# EasyEDA Pro project 2025智能物流搬运_PCB_XAUT_20250927.eprj, board PCB18
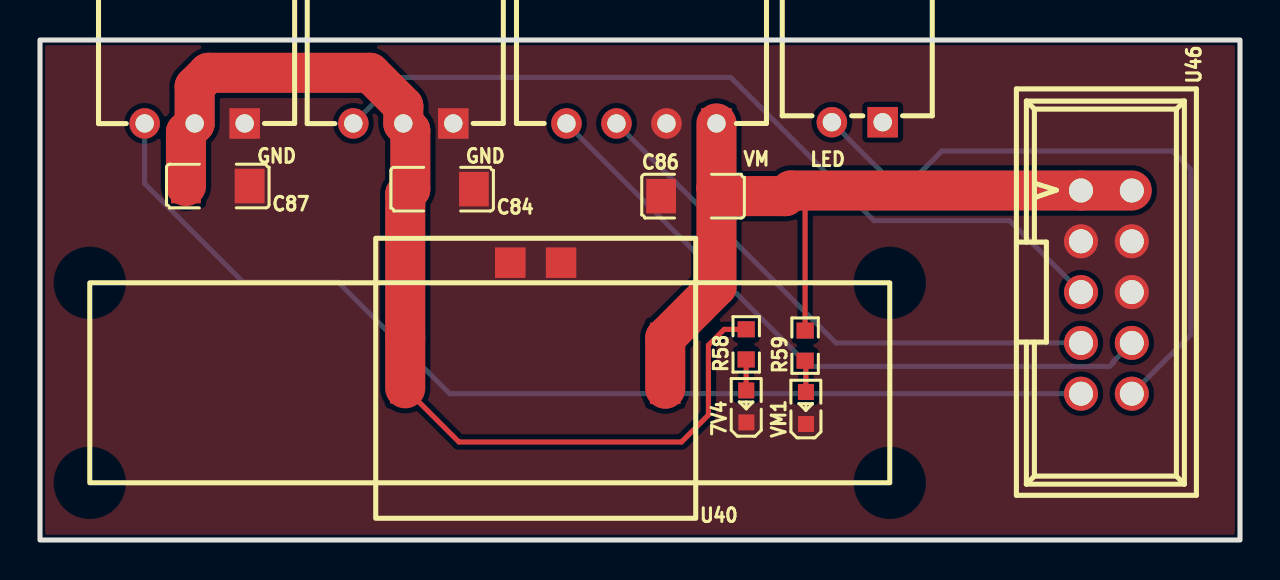
[diagram p13: board, top side]
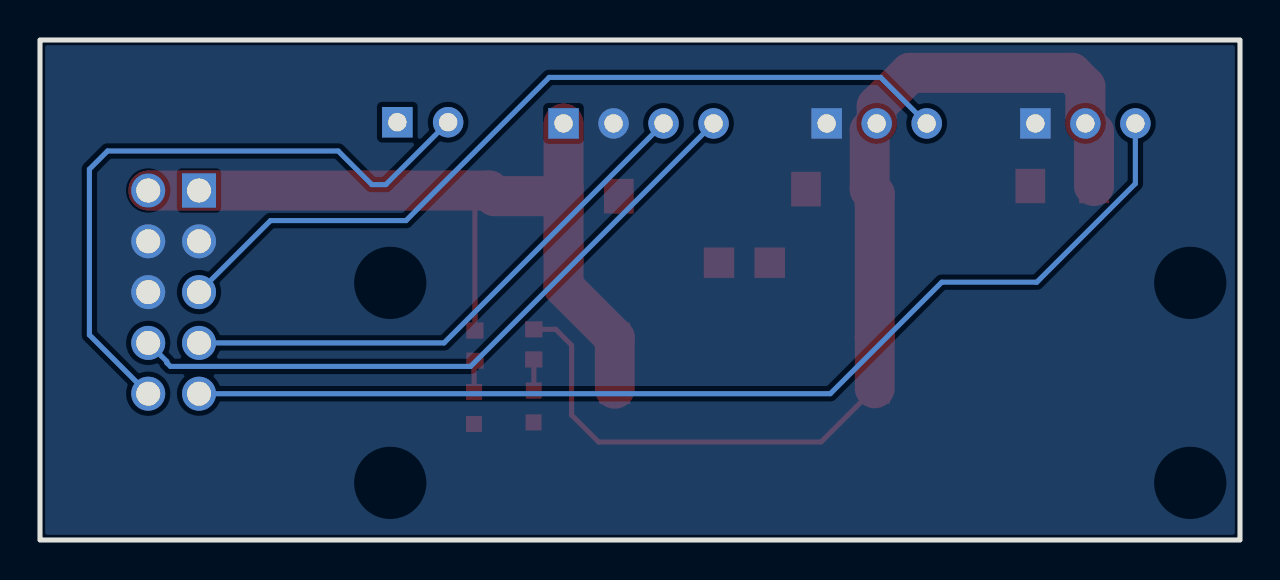
[diagram p14: board, bottom side, seen from below]

Outline 60 x 25 mm; copper layers: Top Layer, Bottom Layer. Coordinates in mm from the lower left corner of the outline.
Outline path: rectangle 0,25 60,0
Stack: Top Layer 0.035mm / Dielectric1 1.51mm FR4 er 4.5 / Bottom Layer 0.035mm

## Design rules (mm)
template: 自定义配置
spacing copperThickness1oz (default): track to track 0.102, other pairs 0.152 to 0.3
spacing copperThickness2oz: track to track 0.203, other pairs 0.152 to 0.3
track width copperThickness1oz (default): min 0.127, default 0.254, max 2.54
track width copperThickness2oz: min 0.203, default 0.254, max 2.54
differential pair differentialPair (default): width min 0.127, default 0.254, max 2.54; gap min 0.152, default 0.152
via viaSize (default): diameter min 0.5, default 0.61, max 10; hole min 0.3, default 0.305, max 6.3
net GND uses copperRegion1

## Placement (name value [footprint] x y rotation side)
7V4  FC-DA1608HRK-620D  [LED0603-RD_RED]  35.32 6.68 90 top
C84  47uF  [C1206]  20.11 17.54 180 top
C86  47uF  [C1206]  32.65 17.19 0 top
C87  47uF  [C1206]  8.89 17.7 180 top
GND  -  [CONN-TH_WAFER-XH254WZ-3A]  18.17 20.83 180 top
GND#2  -  [CONN-TH_WAFER-XH254WZ-3A]  7.73 20.83 180 top
LED  WAFER-XH254WZ-2AM  [CONN-TH_2P-P2.50_WAFER-XH254WZ-2A]  40.86 20.89 180 top
R58  5.1kΩ  [R0603]  35.31 9.78 90 top
R59  47kΩ  [R0603]  38.26 9.72 90 top
U40  -  [THS54302降压]  32.79 15.09 180 top
U46  MTB10-10S  [IDC-TH_MTB110-10S]  53.32 12.39 270 top
VM  WAFER-XH254WZ-4A  [conn-th_4p-p2.50_wafer-xh254wz-4a]  30.07 20.83 180 top
VM1  FC-DA1608HRK-620D  [LED0603-RD_RED]  38.3 6.6 90 top

## Footprints (pads in the part's own frame, mm; a bottom-side part is the same pattern mirrored in y, then rotated)
C1206
  rect 1.485x1.728 smd: 1(-1.593,0) 2(1.593,0)
CONN-TH_2P-P2.50_WAFER-XH254WZ-2A
  rect 1.524x1.524 hole 0.914: 1(-1.27,0)
  round 1.524 hole 0.914: 2(1.27,0)
conn-th_4p-p2.50_wafer-xh254wz-4a
  rect 1.524x1.524 hole 0.914: 1(-3.75,0)
  round 1.524 hole 0.914: 2(-1.25,0) 3(1.25,0) 4(3.75,0)
CONN-TH_WAFER-XH254WZ-3A
  rect 1.524x1.524 hole 0.914: 1(-2.5,0)
  round 1.524 hole 0.914: 2(0,0) 3(2.5,0)
IDC-TH_MTB110-10S
  rect 1.7x1.7 hole 1.2: 1(-5.08,-1.27)
  round 1.7 hole 1.2: 2(-5.08,1.27) 3(-2.54,-1.27) 4(-2.54,1.27) 5(0,-1.27) 6(0,1.27) 7(2.54,-1.27) 8(2.54,1.27) 9(5.08,-1.27) 10(5.08,1.27)
LED0603-RD_RED
  rect 0.8x0.8 smd: 1(-0.799,-0.004) 2(0.799,0.004)
R0603
  rect 0.806x0.864 smd: 1(-0.753,0) 2(0.753,0)
THS54302降压
  rect 1.524x1.524 smd: 1(6.734,1.223) 1(9.274,1.223) 2(14.524,7.502) 2(14.524,4.962) 3(1.524,7.524) 3(1.524,4.984)

## Nets
7V4: C84.2 C87.2 GND.2 GND#2.2 R58.2 U40.2
GND: 7V4.1 C84.1 C86.1 C87.1 GND.1 GND#2.1 U40.1 U46.3 U46.4 U46.6 VM.2 VM1.1
CANH: U46.7 VM.3
CANL: U46.8 VM.4
LED: LED.2 U46.10
PWM1: GND.3 U46.5
PWM2: GND#2.3 U46.9
VM: C86.2 R59.2 U40.3 U46.1 U46.2 VM.1
$1N712: R59.1 VM1.2
$1N728: 7V4.2 R58.1

Pads without a net: LED 1

## Routing (per net, layer and track width the routed paths; a pad name or vN(x,y) marks a point on that pad's centre or on a via; arc(x,y) is an arc through that point)
7V4: length 53.5
  Top Layer w0.254: U40.2 20.95,4.9 32.07,4.9 33.42,6.25 33.42,9.74 34.21,10.53 R58.2
  Top Layer w2: C87.2 7.3,20.39 GND#2.2 7.73,22.67 8.42,23.36 16.5,23.36 18.17,21.69 GND.2 18.51,20.48 C84.2 18.26,17.29 U40.2 U40.2
CANH: length 27.8
  Bottom Layer w0.254: 52.05,9.86 39.8,9.86 VM.3
CANL: length 33.8
  Bottom Layer w0.254: 54.59,9.86 53.66,8.92 53.66,8.86 53.48,8.68 38.47,8.68 VM.4
LED: length 32.7
  Bottom Layer w0.254: LED.2 42.71,17.77 43.41,17.77 45.09,19.45 56.62,19.45 57.53,18.54 57.53,10.26 U46.10
PWM1: length 41.8
  Bottom Layer w0.254: GND.3 17.97,23.13 34.54,23.13 41.7,15.97 48.47,15.97 U46.5
PWM2: length 54.2
  Bottom Layer w0.254: GND#2.3 5.23,17.82 10.16,12.89 14.91,12.89 20.48,7.31 U46.9
VM: length 42
  Top Layer w0.254: R59.2 38.26,17.12
  Top Layer w2: U46.2 U46.1 37.54,17.47 37.26,17.19 C86.2 33.82,17.61 ; U40.3 U40.3 33.82,12.66 33.82,17.61 ; 33.82,17.61 VM.1
$1N712: length 1.6
  Top Layer w0.254: R59.1 38.3,8.92 VM1.2
$1N728: length 1.5
  Top Layer w0.254: 7V4.2 35.31,7.48 35.31,9.03

## Copper pours and planes (outline as drawn; the poured copper is in the pictures)
GND on Top Layer: -4.78,31.7 64.98,31.7 64.98,-7.89 -4.78,-7.89
GND on Bottom Layer: -5.39,29.42 65.41,29.42 65.41,-3.6 -5.39,-3.6
